# Altium schematic sheet Boost.SchDoc
size A4; SheetNumber: 7; SheetTotal: 8
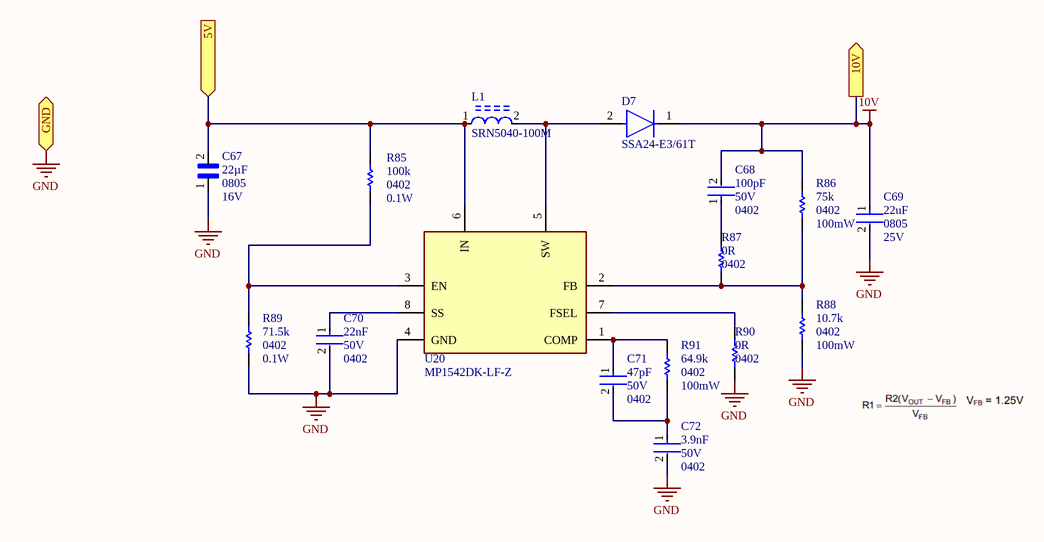
[diagram p0: Boost.SchDoc]

## Parts
C67  value 22µF  Case/Package: 0805  Voltage Rating: 16V  [CAPC0805(2012)145_L]  (hidden comment: CL21A226MOQNNNE)
C68  value 100pF  Package: 0402  Rating: 50V  [FP-CC0402-MFG]  (hidden comment: CC0402KRX7R9BB101)
C69  value 22uF  Package: 0805  Voltage Rating: 25V  [FP-GRM21B-0_2-e0_2_0_7-MFG]  (hidden comment: GRM21BR61E226ME44L)
C70  value 22nF  Case/Package: 0402  Voltage Rating: 50V  [FP-GCM155-0_05-IPC_A]  (hidden comment: GCM155R71H223KA55D)
C71  value 47pF  Package: 0402  Rating: 50V  [FP-C0402-BB-MFG]  (hidden comment: C0402C470J5GACTU)
C72  value 3.9nF  Case/Package: 0402  Voltage Rating: 50V  [FP-CC0402-IPC_A]  (hidden comment: CC0402KRX7R9BB392)
D7  SSA24-E3/61T  [FP-95400-MFG]
L1  SRN5040-100M  [FP-SRN5040-MFG]
R85  value 100k  Package: 0402  MOQ: 0.1W  [RESC1005X40X25LL10T10]  (hidden comment: RK73H1ETTP1003F)
R86  value 75k  Case/Package: 0402  Power: 100mW  [RESC1005X40X25LL10T10]  (hidden comment: RK73H1ETTP7502F)
R87  value 0R  Package: 0402  [FP-RK73Z1E-IPC_B]  (hidden comment: RK73Z1ETTP)
R88  value 10.7k  Power: 100mW  Case/Package: 0402  [RESC1005X40X25LL10T10]  (hidden comment: RK73H1ETTP1072F)
R89  value 71.5k  Mounting: 0402  Package: 0.1W  [RESC1005X40X25LL10T10]  (hidden comment: RK73H1ETTP7152F)
R90  value 0R  Package: 0402  [FP-RK73Z1E-IPC_B]  (hidden comment: RK73Z1ETTP)
R91  value 64.9k  Case/Package: 0402  Power: 100mW  [RESC1005X40X25LL10T10]  (hidden comment: RK73H1ETTP6492F)
U20  MP1542DK-LF-Z  [MP1542-Footprint-1]

## Ports
5V (in), 10V (out), GND (bidir)

## Nets
10V: C68.2 C69.1 D7.1(C) R86.2 ; port 10V
GND: C67.1 C69.2 C70.2 C72.2 R88.1 R89.1 R90.1 U20.4(GND) ; port GND
5V: C67.2 L1.1 R85.2 U20.6(IN) ; port 5V
NetC68_1: C68.1 R87.2
NetC70_1: C70.1 U20.8(SS)
NetC71_1: C71.1 R91.2 U20.1(COMP)
NetC71_2: C71.2 C72.1 R91.1
NetD7_2: D7.2(A) L1.2 U20.5(SW)
NetR85_1: R85.1 R89.2 U20.3(EN)
NetR86_1: R86.1 R87.1 R88.2 U20.2(FB)
NetR90_2: R90.2 U20.7(FSEL)

## Notes on the sheet
- Title:
- Date:
- Drawn By:
- Time:
- Checked By:
- File:
- Sheet
- of

## Library data of the parts
C67 = CMP-001-00081-17: Chip Capacitor, 22µF +/-40%, 16V, 0805, Thickness 1.45 mm; Tolerance: 5%; Max Operating Temperature: 85°C; Pins: 2; Mounting Technology: SMT; Min Operating Temperature: -55°C
C68 = CMP-x00153-2: Ceramic Capacitor, Multilayer, Ceramic, 50V, 10% +Tol, 10% -Tol, X7R, 15% TC, 0.0001uF, Surface Mount, 0402; Template: YG_0402_C
C69 = CMP-x00061-2: Ceramic Capacitor, Multilayer, Ceramic, 25V, 20% +Tol, 20% -Tol, X5R, 15% TC, 22uF, Surface Mount, 0805; Manufacturer: Murata; Vendor: TTI; Reel Width: 8mm; Template: MR_0805; Price: 0.093; MOQ: 3000; Category: Capacitor; Mounting: SMT
C70 = CMP-001-00345-1: Ceramic Capacitor, Multilayer, Ceramic, 50V, 10% +Tol, 10% -Tol, X7R, 15% TC, 0.022uF, Surface Mount, 0402; RoHS Compliant: Yes; Min Operating Temperature: -55°C; Pins: 2; Mounting Technology: Surface Mount; Max Operating Temperature: 125°C; Capacitor Type: Ceramic
C71 = CMP-x00009-2: Ceramic Capacitor, Multilayer, Ceramic, 50V, 5% +Tol, 5% -Tol, C0G, 30ppm/Cel TC, 0.000047uF, Surface Mount, 0402; Price: 0.0022; Mounting: SMT; MOQ: 10000
C72 = CMP-001-00344-1: Ceramic Capacitor, Multilayer, Ceramic, 50V, 10% +Tol, 10% -Tol, X7R, 15% TC, 0.0039uF, Surface Mount, 0402; Mounting Technology: Surface Mount; Capacitor Type: Ceramic; RoHS Compliant: Yes; Pins: 2; Min Operating Temperature: -55°C; Max Operating Temperature: 125°C
D7 = CMP-x00060-3: Rectifier Diode, Schottky, 1 Phase, 1 Element, 2A, 40V V(RRM), Silicon, DO-214AC; Manufacturer: Vishay; Template: VS_DO214; Vendor: TTI; Reel Width: 12mm; Value: 40V; Package: DO214AC; Price: 0.04; MOQ: 1800; Mounting: SMT; Category: Diode
L1 = CMP-x00063-2: General Purpose Inductor, 10uH, 20%, 1 Element, Ferrite-Core, SMD, 2020; Manufacturer: Bourns; Vendor: TTI; Reel Width: 12mm; Template: BR_5040; MOQ: 1000; Price: 0.18; Value: 10uH; Mounting: SMT; Category: Inductor; Package: 5040
R85 = CMP-x00162-2: Fixed Resistor, Metal Glaze/thick Film, 0.1W, 100000ohm, 75V, 1% +/-Tol, 100ppm/Cel, Surface Mount, 0402; Manufacturer: KOA Speer; Template: KS_0402_R; Mounting: SMD; Category: Resistors
R86 = CMP-009-01025-1: Fixed Resistor, Metal Glaze/thick Film, 0.1W, 75000ohm, 75V, 1% +/-Tol, 100ppm/Cel, Surface Mount, 0402; Max Operating Temperature: 155°C; RoHS Compliant: Yes; Tolerance: 1%; Pins: 2; Min Operating Temperature: -55°C; Mounting Technology: Surface Mount
R87 R90 = CMP-x00147-2: Metal Glaze/thick Film, 0ohm, Surface Mount, 0402; Template: KS_0402_R
R88 = CMP-009-01026-1: Fixed Resistor, Metal Glaze/thick Film, 0.1W, 10700ohm, 75V, 1% +/-Tol, 100ppm/Cel, Surface Mount, 0402; Max Operating Temperature: 155°C; RoHS Compliant: Yes; Pins: 2; Mounting Technology: Surface Mount; Tolerance: 1%; Min Operating Temperature: -55°C
R89 = CMP-x00176-1: Fixed Resistor, Metal Glaze/thick Film, 0.1W, 71500ohm, 75V, 1% +/-Tol, 100ppm/Cel, Surface Mount, 0402
R91 = CMP-009-01027-1: Fixed Resistor, Metal Glaze/thick Film, 0.1W, 64900ohm, 75V, 1% +/-Tol, 100ppm/Cel, Surface Mount, 0402; Mounting Technology: Surface Mount; Max Operating Temperature: 155°C; Pins: 2; Tolerance: 1%; Min Operating Temperature: -55°C; RoHS Compliant: Yes
U20 = CMP-x00054-4: Switching Regulator, Current-mode, 2A, 1500kHz Switching Freq-Max, PDSO8; Manufacturer: MPS; Value: 3V - 22V; Vendor: Mouser; Template: MP_MSOP_8; Reel Width: 12mm; Package: MSOP-8; Price: 1.25; MOQ: 2500; Mounting: SMT; Category: IC